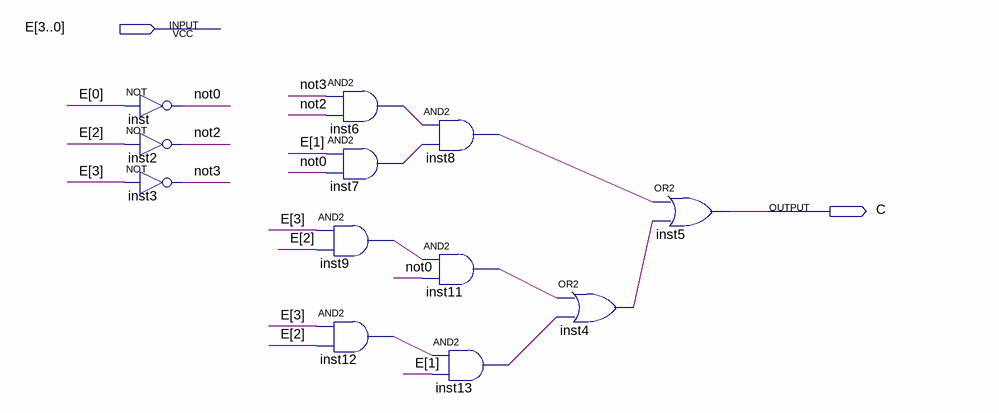
[diagram p0: schematic sheet]
// Quartus schematic displayC.bdf as structural Verilog: 12 symbols, 2 pins
module displayC (
  input  [3:0] E,
  output C
);

  wire inst4_out, inst6_out, inst7_out, inst8_out, inst9_out, inst11_out, inst12_out, inst13_out, not0, not2,
       not3;

  not inst (not0, E[0]);
  not inst2 (not2, E[2]);
  not inst3 (not3, E[3]);
  and inst6 (inst6_out, not3, not2);
  and inst7 (inst7_out, E[1], not0);
  and inst9 (inst9_out, E[3], E[2]);
  and inst12 (inst12_out, E[3], E[2]);
  and inst8 (inst8_out, inst6_out, inst7_out);
  and inst11 (inst11_out, inst9_out, not0);
  and inst13 (inst13_out, inst12_out, E[1]);
  or inst4 (inst4_out, inst11_out, inst13_out);
  or inst5 (C, inst8_out, inst4_out);
endmodule
